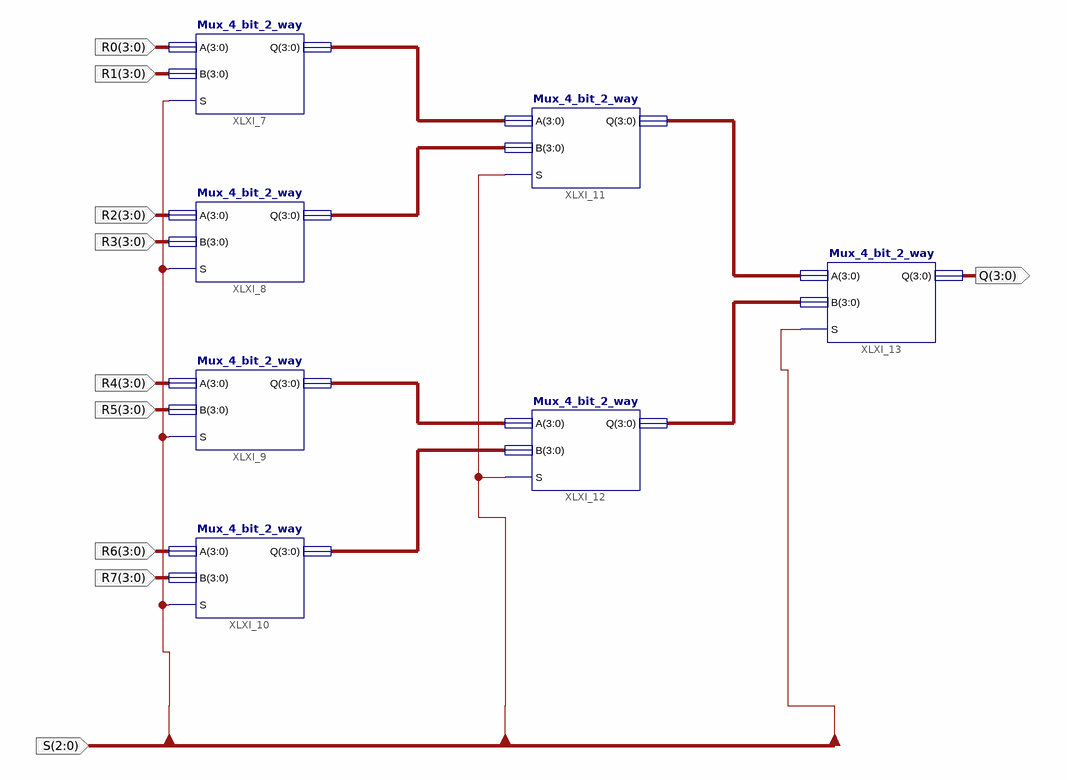
[diagram p0: schematic sheet 1]
// Xilinx ISE schematic Mux_4_bit_8_way.sch (spartan3e) as structural Verilog: 7 symbols, 10 ports
module Mux_4_bit_8_way (
  input  [3:0] R0,
  input  [3:0] R1,
  input  [3:0] R2,
  input  [3:0] R3,
  input  [3:0] R4,
  input  [3:0] R5,
  input  [3:0] R6,
  input  [3:0] R7,
  input  [2:0] S,
  output [3:0] Q
);

  wire [3:0] XLXN_9, XLXN_10, XLXN_11, XLXN_12, XLXN_14, XLXN_15;

  Mux_4_bit_2_way XLXI_7 (.A(R0), .B(R1), .Q(XLXN_9), .S(S[0]));
  Mux_4_bit_2_way XLXI_8 (.A(R2), .B(R3), .Q(XLXN_10), .S(S[0]));
  Mux_4_bit_2_way XLXI_9 (.A(R4), .B(R5), .Q(XLXN_11), .S(S[0]));
  Mux_4_bit_2_way XLXI_10 (.A(R6), .B(R7), .Q(XLXN_12), .S(S[0]));
  Mux_4_bit_2_way XLXI_11 (.A(XLXN_9), .B(XLXN_10), .Q(XLXN_14), .S(S[1]));
  Mux_4_bit_2_way XLXI_12 (.A(XLXN_11), .B(XLXN_12), .Q(XLXN_15), .S(S[1]));
  Mux_4_bit_2_way XLXI_13 (.A(XLXN_14), .B(XLXN_15), .Q(Q), .S(S[2]));
endmodule
